# Altium schematic sheet 53L0-SATEL-I1.SchDoc: VL53L0X Satellite Board
size A4; Date: 2022 Fall; Address1: LK Bulls; Address2: Bagoly Zoltan; Address3: Feher Daniel; Address4: G. Varga Gabor; DocumentNumber: 9; Revision: 1.0; SheetNumber: 9; SheetTotal: 14
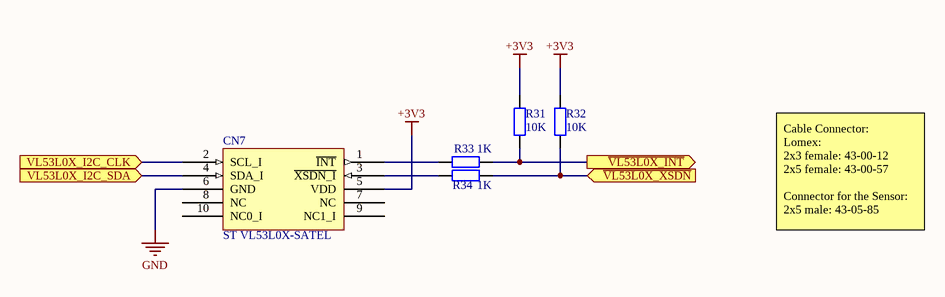
[diagram p0: 53L0-SATEL-I1.SchDoc]

## Parts
CN7  ST VL53L0X-SATEL  [FP_DISTANCE_SENSOR]
R31  10K  [FP_0805_RES]
R32  10K  [FP_0805_RES]
R33  1K  [FP_0805_RES]
R34  1K  [FP_0805_RES]

## Ports
VL53L0X_I2C_CLK (in), VL53L0X_I2C_SDA (in), ~{VL53L0X_INT} (out), ~{VL53L0X_XSDN} (in)

## Nets
+3V3: CN7.5(VDD) R31.1 R32.1
GND: CN7.6(GND)
~{VL53L0X_INT}: R31.2 R33.2 ; port ~{VL53L0X_INT}
~{VL53L0X_XSDN}: R32.2 R34.2 ; port ~{VL53L0X_XSDN}
VL53L0X_I2C_CLK: CN7.2(SCL_I) ; port VL53L0X_I2C_CLK
VL53L0X_I2C_SDA: CN7.4(SDA_I) ; port VL53L0X_I2C_SDA
NetCN7_1: CN7.1(~{INT}) R33.1
NetCN7_3: CN7.3(~{XSDN_I}) R34.1

Not connected (* = marked no-connect by the designer): CN7 7(NC) 8(NC) 9(NC1_I) 10(NC0_I)

## Notes on the sheet
- Cable Connector:
  Lomex:
  2x3 female: 43-00-12
  2x5 female: 43-00-57
  Connector for the Sensor:
  2x5 male: 43-05-85
- Title
- Size:
- Date:
- A4
- Number:
- Revision:
- Sheet
- of
- Designed by:
- File:

## Library data of the parts
CN7 = ST_53L0-SATEL-I1: 53L0-SATEL-I1 satellite board for ranging sensor (max distance 2m); Name: SZAL.KABEL 6 P APA BH-06 (T-T); Supplier: Lomex; Reference: 43-26-63
R31 R32 = RES: Resistor; Tolerance: 5%; Power: 0.125W; Name: 10K0 0805 5% CR-05JL7---10K 0.125W (VIK); Supplier: Lomex; Reference: 81-10-99; Value: 10K
R33 R34 = RES: Resistor; Tolerance: 5%; Power: 0.125W; Name: 1K00 0805 5% CR-05JL7----1K 0.125W (VIK); Supplier: Lomex; Reference: 81-10-87; Value: 1K